# EAGLE design HVPS_SMD-eagle (EAGLE 7.6.0)
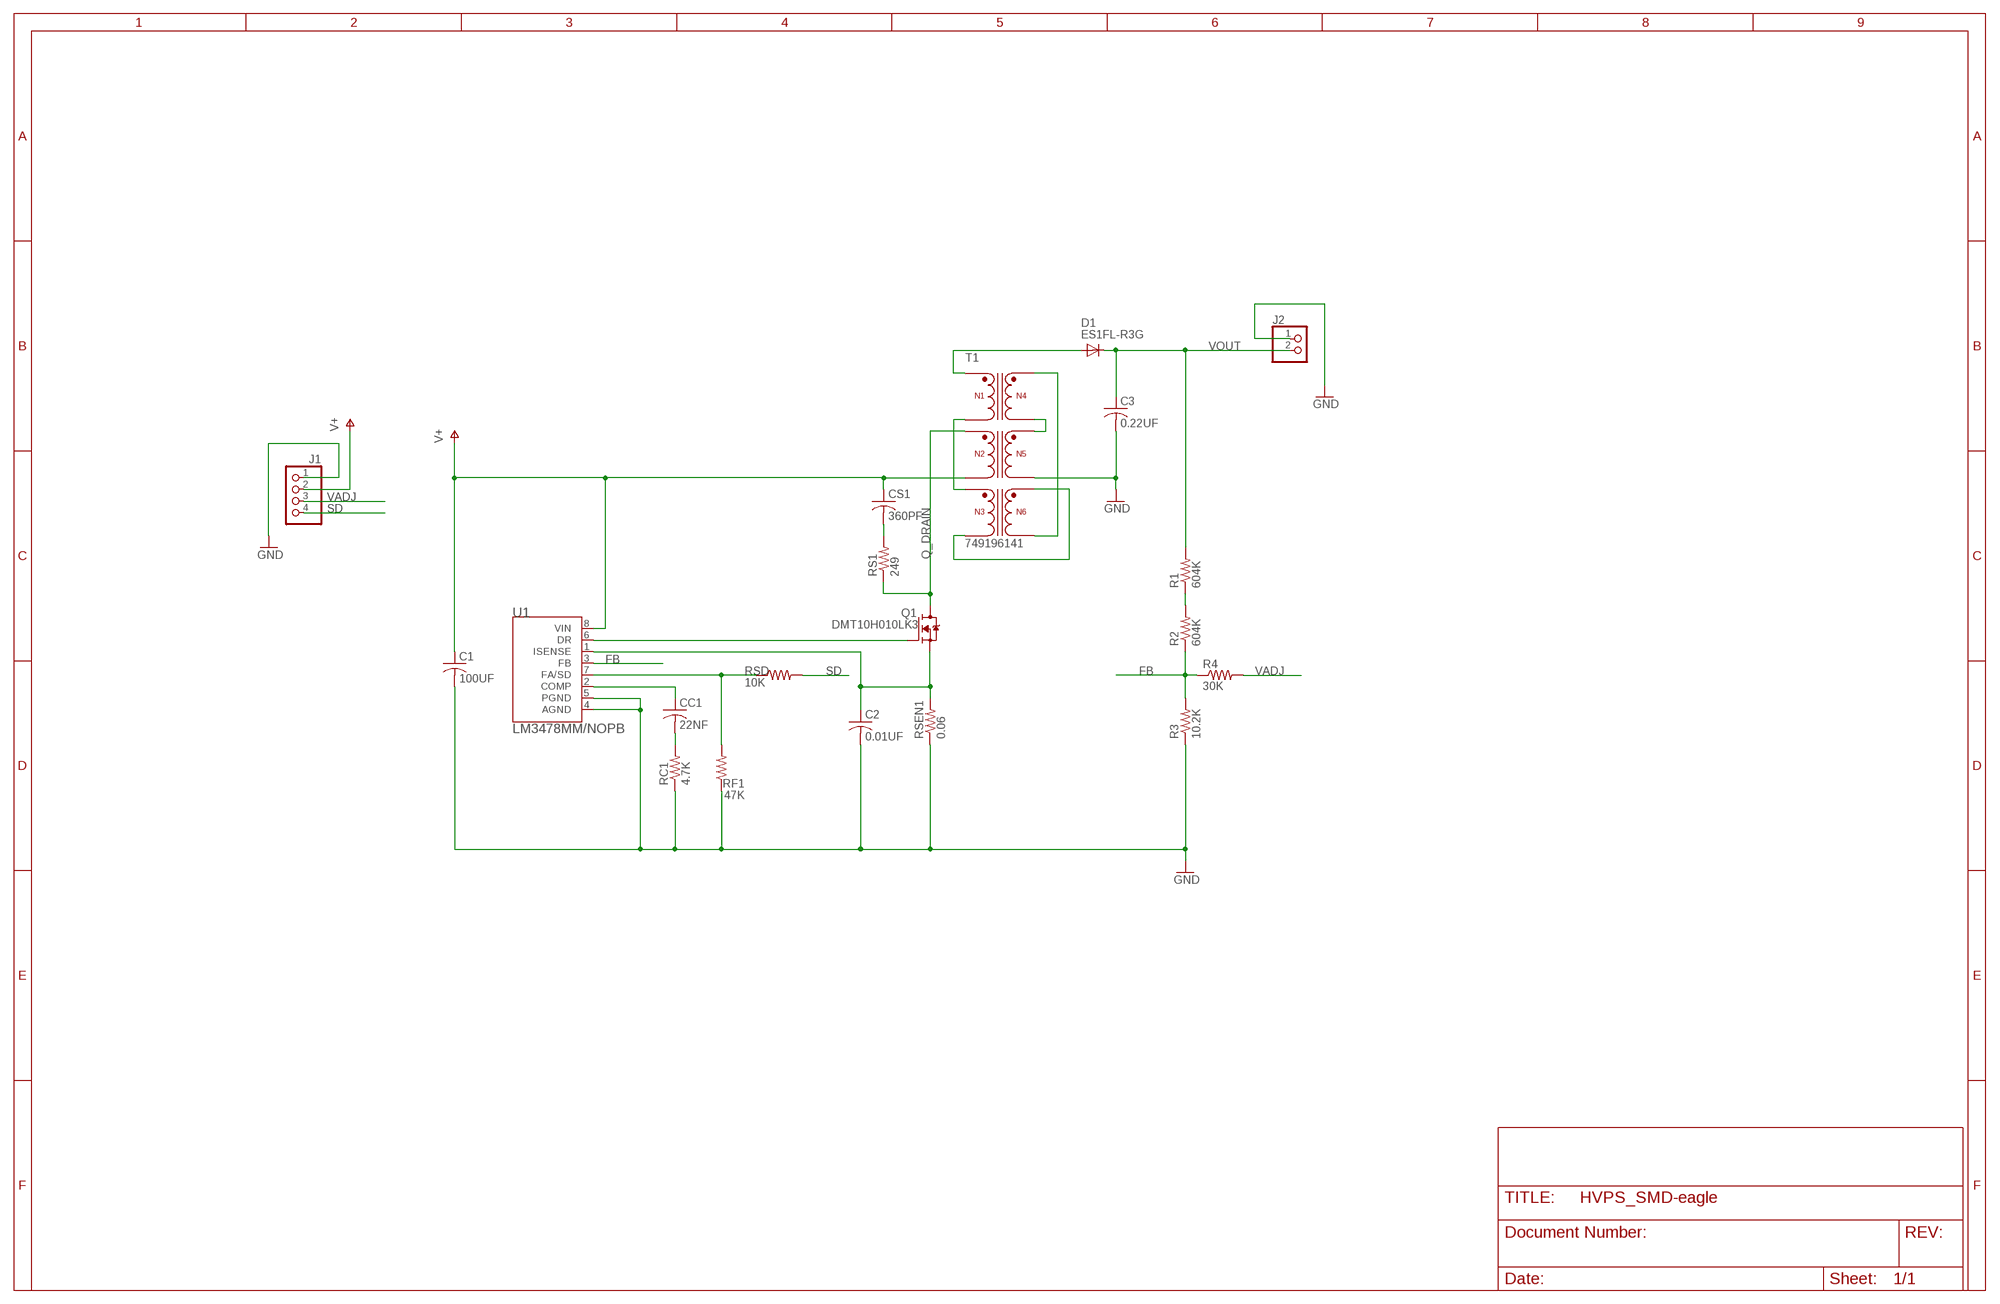
[diagram p0: schematic, sheet 1]

## Parts
C1  100UF  C-USC1210  [C1210]
C2  0.01UF  C-USC0603  [C0603]
C3  0.22UF  C-USC1210  [C1210]
CC1  22NF  C-USC0603  [C0603]
CS1  360PF  C-USC0603  [C0603]
D1  ES1FL-R3G  [SMA]
J1  PINHD-1X4  [1X04]
J2  PINHD-1X2  [1X02]
Q1  DMT10H010LK3  [TO252]
R1  604K  R-US_R0805  [R0805]
R2  604K  R-US_R0805  [R0805]
R3  10.2K  R-US_R0603  [R0603]
R4  30K  R-US_R0603  [R0603]
RC1  4.7K  R-US_R0805  [R0805]
RF1  47K  R-US_R0603  [R0603]
RS1  249  R-US_R1206  [R1206]
RSD  10K  R-US_R0603  [R0603]
RSEN1  0.06  R-US_R2010  [R2010]
T1  749196141  [749196141]
U1  LM3478MM/NOPB  [MUA08A]

## Nets
FB: R2.1 R3.2 R4.1 U1.3(FB)
GND: C1.2 C2.2 C3.2 J1.1 J2.1 R3.1 RC1.1 RF1.1 RSEN1.1 T1.8(N5) U1.4(AGND) U1.5(PGND)
N$1: RF1.2 RSD.1 U1.7(FA/SD)
N$2: CC1.1 U1.2(COMP)
N$3: CC1.2 RC1.2
N$4: C2.1 Q1.2(S) RSEN1.2 U1.1(ISENSE)
N$6: T1.3(N3) T1.4(N1)
N$7: T1.6(N3) T1.12(N6)
N$8: CS1.2 RS1.2
N$9: T1.9(N6) T1.10(N4)
N$10: T1.7(N4) T1.11(N5)
N$11: Q1.1(G) U1.6(DR)
N$12: D1.A T1.1(N1)
N$14: R1.1 R2.2
Q_DRAIN: Q1.3(D) RS1.1 T1.2(N2)
SD: J1.4 RSD.2
V+: C1.1 CS1.1 J1.2 T1.5(N2) U1.8(VIN)
VADJ: J1.3 R4.2
VOUT: C3.1 D1.C J2.2 R1.2

## Library data of the parts
C1-C3 CC1 CS1 = rcl:C-US: CAPACITOR, American symbol
D1 = HVPS_SMD-eagle:ES1FL-R3G
J1 = pinhead:PINHD-1X4: PIN HEADER
J2 = pinhead:PINHD-1X2: PIN HEADER
Q1 = HVPS_SMD-eagle:DMT10H010LK3
R1-R4 RC1 RF1 RS1 RSD RSEN1 = rcl:R-US_: RESISTOR, American symbol
T1 = HVPS_SMD-eagle:749196141
U1 = HVPS_SMD-eagle:LM3478MM/NOPB; MANUFACTURER_PART_NUMBER: LM3478MMNOPB; VENDOR: Texas Instruments

## Board
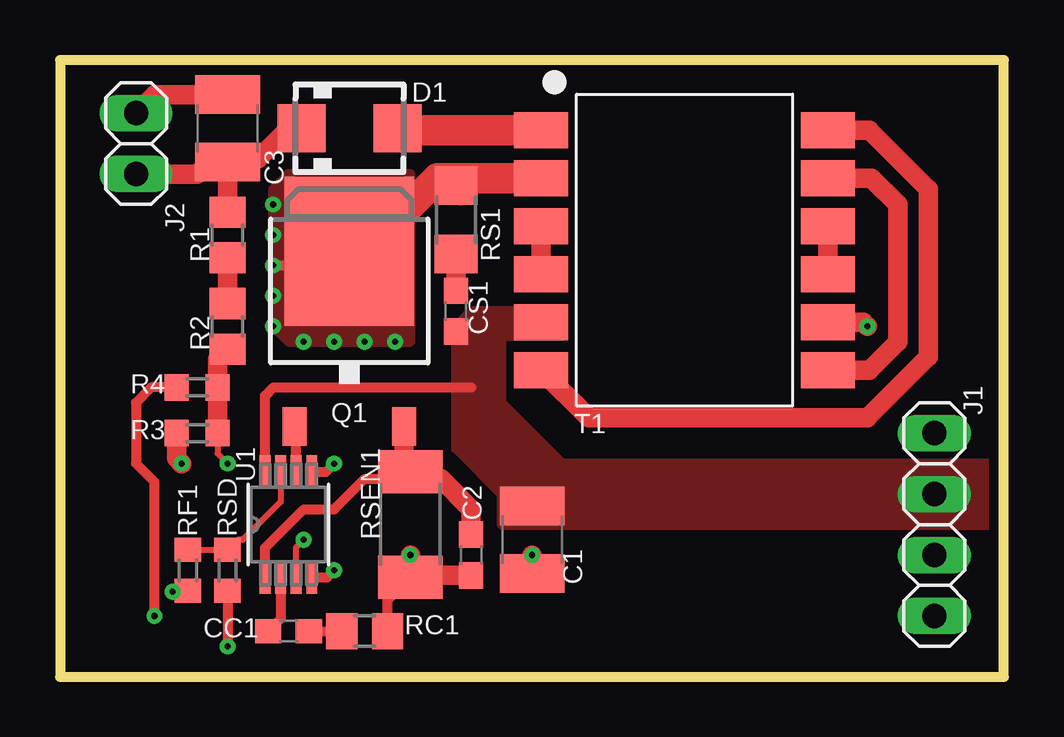
[diagram p1: board, top side]
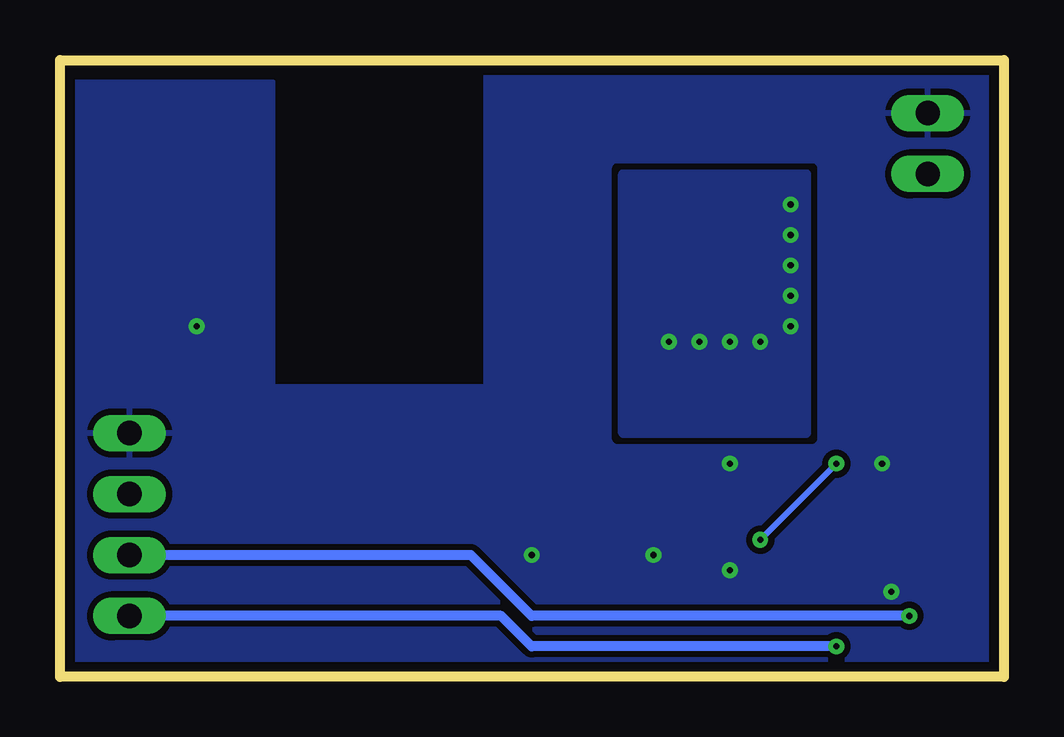
[diagram p2: board, bottom side, seen from below]

Size 39.35 x 25.7 mm. Coordinates in mm from the lower left corner, seen from the top.
Outline: 0,0 39.35,0 39.35,25.7 0,25.7 0,0
Copper layers (1*16): Top 0.035mm / dielectric 1.5mm / Bottom 0.035mm
Design rules "default *": minimum track width 6mil, minimum drill 10mil, track to track 8mil, track to pad 8mil, pad to pad 8mil, via to via 8mil, smd to smd 0mil, copper to edge 16mil, drill to drill 8mil, minimum pad ring 10mil, minimum via ring 8mil, stop-mask expansion 4mil, vias tented up to drill 0mil, thermal gap 10mil

### Footprints (pad centres in the part's own frame; a part is rotated, then mirrored left to right if it is on the bottom)
C1210 = smd 1.6 x 2.7: 1 -1.4,0; 2 1.4,0
C0603 = smd 1.1 x 1: 1 -0.85,0; 2 0.85,0
SMA = smd 2 x 2: A 2,0; C -2,0
1X04 = drill 1.016 long: 1 -3.81,0; 2 -1.27,0; 3 1.27,0; 4 3.81,0
1X02 = drill 1.016 long: 1 -1.27,0; 2 1.27,0
TO252 = smd 1 x 1.6: 1 -2.28,-4.8; 2 2.28,-4.8 | smd 5.4 x 6.2: 3 0,2.5
R0805 = smd 1.3 x 1.5: 1 -0.95,0; 2 0.95,0
R0603 = smd 1 x 1.1: 1 -0.85,0; 2 0.85,0
R1206 = smd 1.6 x 1.803: 1 -1.422,0; 2 1.422,0
R2010 = smd 1.8 x 2.7: 1 -2.2,0; 2 2.2,0
749196141 = smd 1.5 x 2.25: 1 -5,-5.975; 2 -3,-5.975; 3 -1,-5.975; 4 1,-5.975; 5 3,-5.975; 6 5,-5.975; 7 5,5.975; 8 3,5.975; 9 1,5.975; 10 -1,5.975; 11 -3,5.975; 12 -5,5.975
MUA08A = smd 1.372 x 0.457: 1 -2.197,0.975; 2 -2.197,0.325; 3 -2.197,-0.325; 4 -2.197,-0.975; 5 2.197,-0.975; 6 2.197,-0.325; 7 2.197,0.325; 8 2.197,0.975

### Placement (x,y rotation side)
C1  19.68,5.71 270 top
C2  17.14,5.08 270 top
C3  6.99,22.86 90 top
CC1  9.53,1.91 0 top
CS1  16.51,15.24 90 top
D1  12.06,22.86 0 top
J1  36.45,6.35 270 top
J2  3.17,22.23 270 top
Q1  12.06,15.24 0 top
R1  6.99,18.41 90 top
R2  6.99,14.61 90 top
R3  5.71,10.16 0 top
R4  5.71,12.06 180 top
RC1  12.7,1.91 180 top
RF1  5.33,4.45 90 top
RS1  16.51,19.05 270 top
RSD  6.99,4.45 270 top
RSEN1  14.61,6.35 90 top
T1  26.04,17.78 270 top
U1  9.53,6.35 90 top

### Tracks (layer width: path | path; a pad name or v marks a point on that pad's centre or on a via)
FB  (via drill 0.25 pad 0.41)
  Top 0.254: U1.3 9.85,5.41 v10.16,5.71 | R3.2 6.57,9.31 v6.99,8.89
  Top 0.813: R2.1 6.57,13.23 R4.1 R3.2
  Bottom 0.254: v10.16,5.71 v6.99,8.89
GND  (via drill 0.25, 0.25 pad 0.41)
  Top 0.254: RF1.1 4.7,3.6 v4.7,3.56
  Top 0.406: U1.4 11.14,4.15 v11.43,4.45 | U1.5 11.09,8.55 v11.43,8.89 | RC1.1 13.65,3.19 RSEN1.1
  Top 0.813: T1.8 33.48,14.78 v33.66,14.61 | v19.68,5.08 C1.2 | v14.61,5.08 RSEN1.1 14.69,4.23 C2.2 | C3.2 3.94,24.26 J2.1 | R3.1 4.87,9.11 v5.08,8.89
  pour Bottom (isolate 0.254, rank 2): 0.64,25.4 21.59,25.4 21.59,12.06 30.48,12.06 30.48,24.77 38.73,24.77 38.73,0 0.64,0
N$1
  Top 0.254: U1.7 9.2,7.29 7.62,5.71 7.41,5.71 RSD.1 RF1.2
N$2
  Top 0.406: U1.2 9.2,2.43 CC1.1
N$3
  Top 0.406: CC1.2 RC1.2
N$4
  Top 0.406: U1.1 8.55,5.38 10.16,6.99 11.43,6.99 12.7,8.26 14.31,8.26 RSEN1.2
  Top 0.813: Q1.2 14.35,8.81 RSEN1.2 14.9,8.26 15.88,8.26 17.14,6.99 C2.1
N$6
  Top 0.813: T1.3 T1.4
N$7
  Top 0.813: T1.12 33.73,22.78 36.2,20.32 36.2,13.34 33.66,10.79 22.05,10.79 T1.6
N$8
  Top 0.813: CS1.2 RS1.2
N$9
  Top 0.813: T1.9 T1.10
N$10
  Top 0.813: T1.7 33.73,12.78 34.92,13.97 34.92,19.68 33.83,20.78 T1.11
N$11
  Top 0.406: U1.6 9.85,10.38 Q1.1
N$12
  Top 1.27: T1.1 14.14,22.78 D1.A
N$14
  Top 0.813: R1.1 R2.2
Q_DRAIN  (via drill 0.25 pad 0.41)
  Top 0.406: v8.89,17.14 11.47,17.14 Q1.3
  Top 1.016: RS1.1 17.14,20.78
  Top 1.27: T1.2 17.14,20.78 15.74,20.78 13.34,18.41 12.66,17.74 Q1.3 | 16.7,20.28 RS1.1
  other vias: 8.89,19.68 8.89,18.41 8.89,15.88 8.89,14.61 10.16,13.97 11.43,13.97 12.7,13.97 13.97,13.97
  pour Bottom: 8.26,20.95 8.26,10.16 15.88,10.16 15.88,20.95
  pour Top (no thermals): 9.53,20.95 8.89,20.32 8.89,14.61 9.53,13.97 14.61,13.97 14.61,20.95
SD  (via drill 0.25 pad 0.41)
  Top 0.406: RSD.2 v6.99,1.27
  Bottom 0.406: v6.99,1.27 19.68,1.27 20.95,2.54 J1.4
V+
  Top 0.406: U1.8 8.55,11.72 8.89,12.06 17.14,12.06
  pour Top (no thermals): 20.95,15.24 17.14,15.24 16.51,14.61 16.51,9.53 18.41,7.62 18.41,6.35 38.73,6.35 38.73,8.89 20.95,8.89 18.41,11.43 18.41,14.22 20.95,14.22
VADJ  (via drill 0.25 pad 0.41)
  Top 0.406: R4.2 3.81,12.06 3.17,11.43 3.17,8.89 3.94,8.13 v3.94,2.54
  Bottom 0.406: v3.94,2.54 19.68,2.54 22.23,5.08 J1.3
VOUT
  Top 0.813: D1.C 9.53,22.86 8.26,21.59 7.12,21.59 C3.1 | C3.1 R1.2 | C3.1 6.22,21.46 5.71,20.95 J2.2

### Text on the board
Document: --- | +++ | !! 200V OUT !! | GND | 3V-12V | VADJ | SD | Rev A